# EAGLE design NumberMaze (EAGLE 7.6.0)
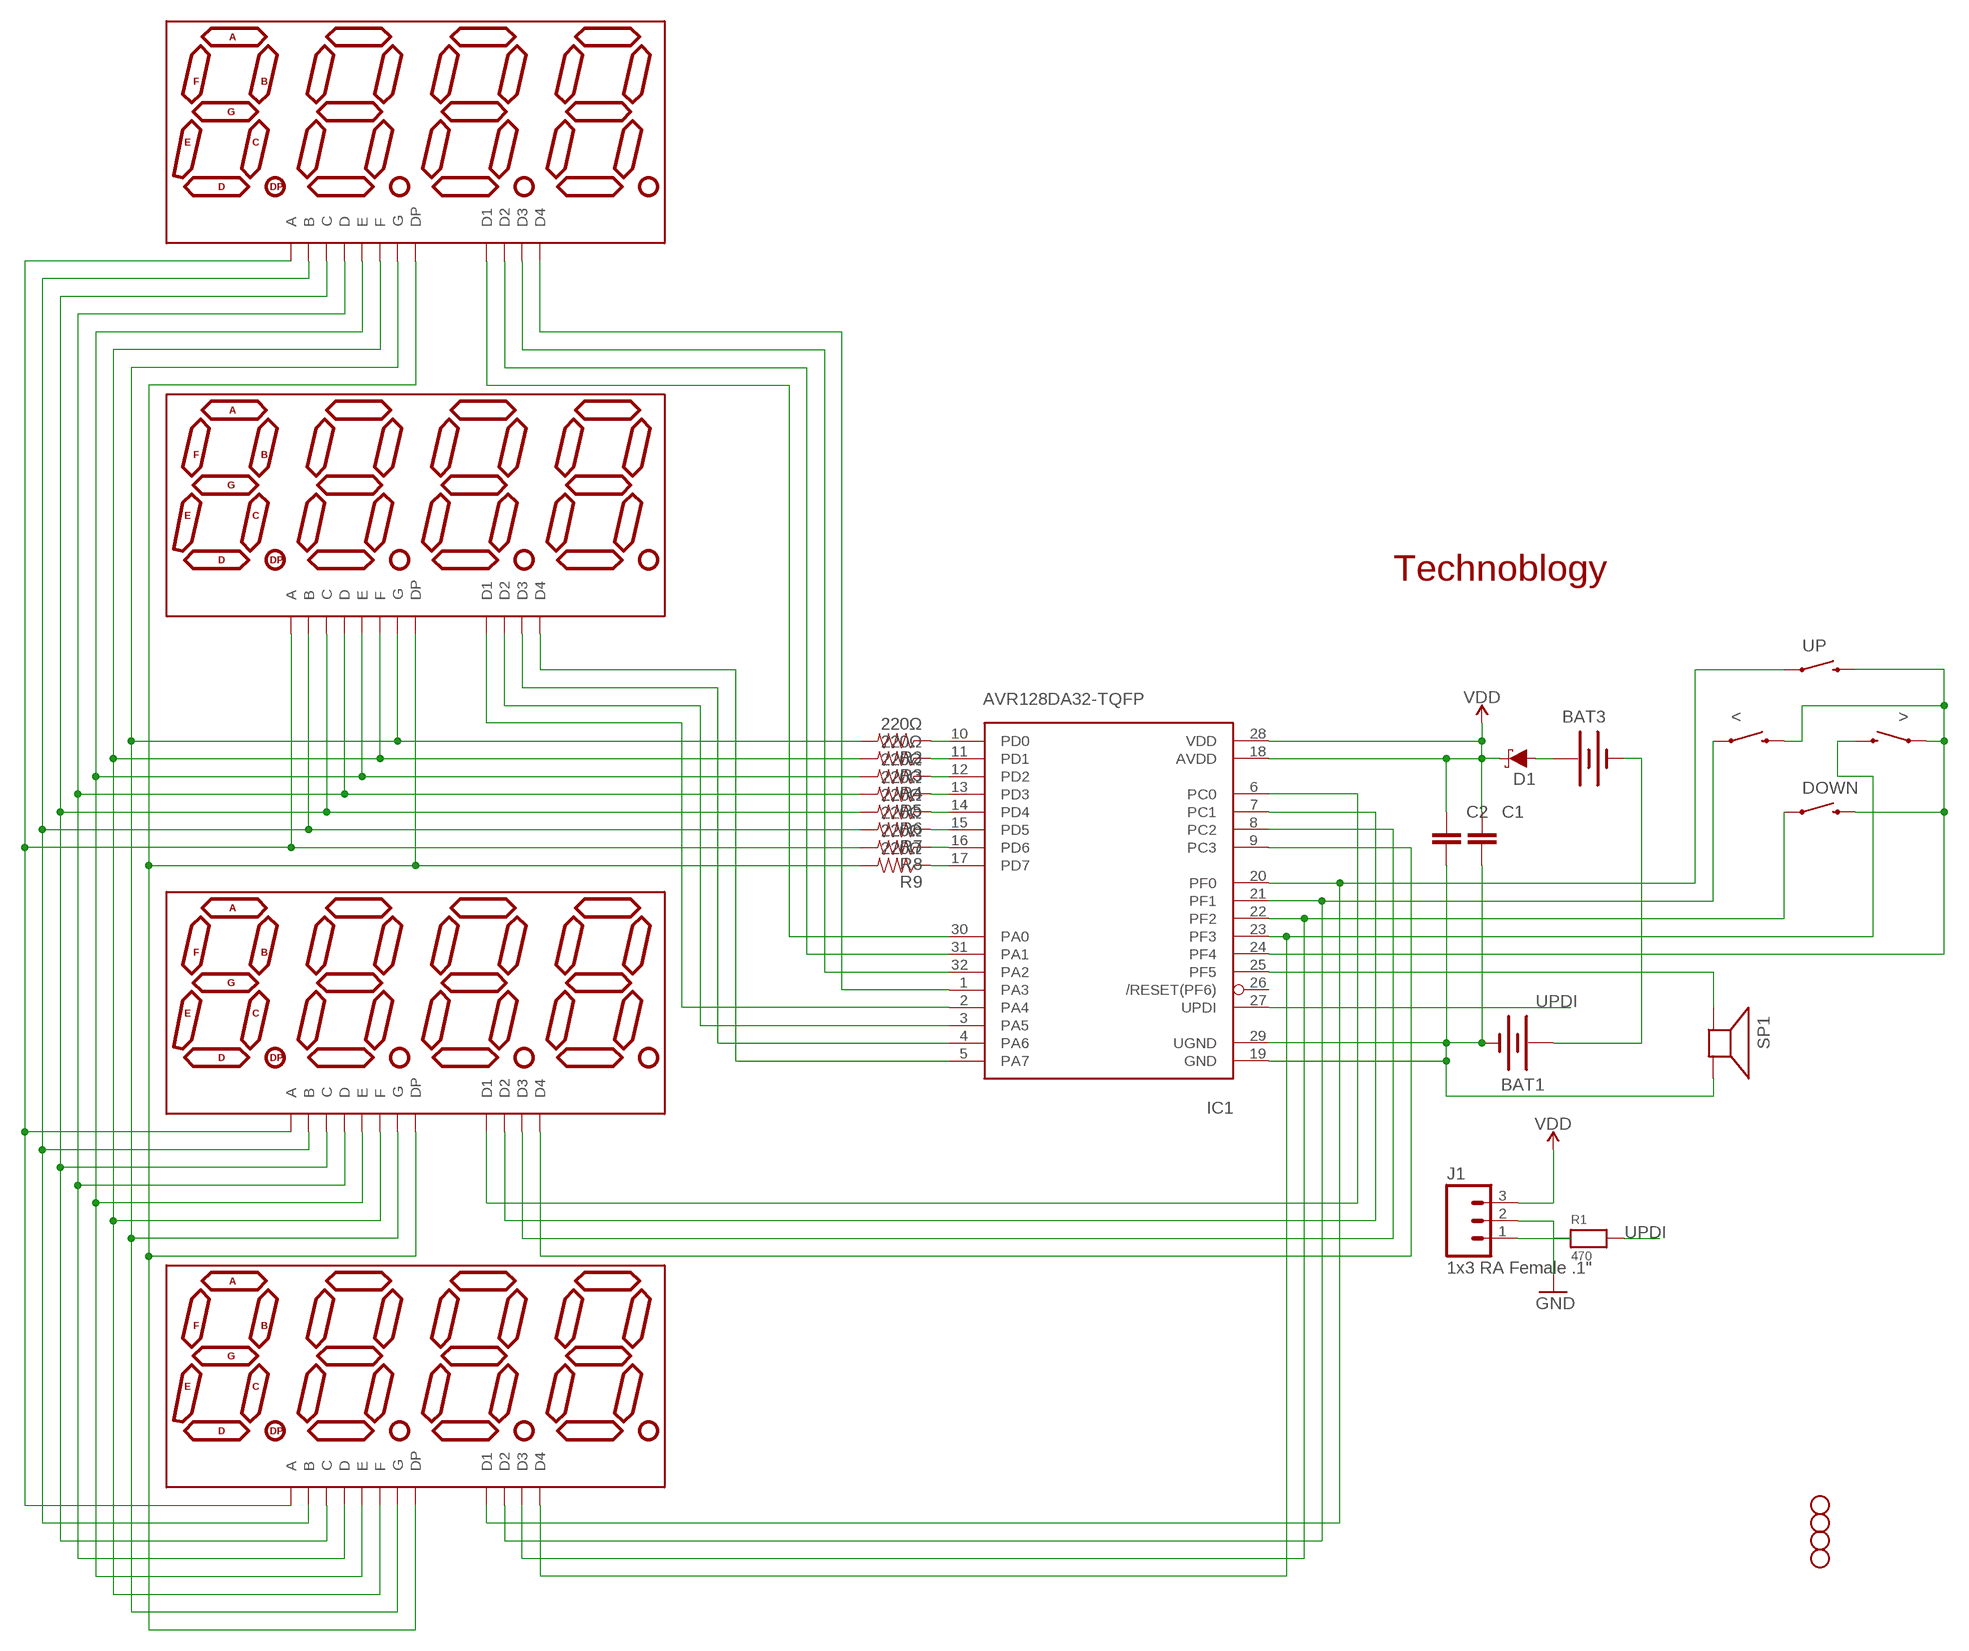
[diagram p0: schematic, sheet 1]

## Parts
<  SWITCH-MOMENTARY-2PTH  [TACTILE-PTH]
>  SWITCH-MOMENTARY-2PTH  [TACTILE-PTH]
BAT1  BATTERYAA-KIT  [BATTERY-AA-KIT]
BAT3  BATTERYAA-KIT  [BATTERY-AA-KIT]
C1  100n  CAP0805  [0805]
C2  100n  CAP0805  [0805]
D1  3A/10V/280mV  DIODE-SCHOTTKY-BAT60A  [SOD-323]
DISP1  KYX-2381  LD-2481-KYX-2381  [KYX-2381]
DISP2  KYX-2381  LD-2481-KYX-2381  [KYX-2381]
DISP3  KYX-2381  LD-2481-KYX-2381  [KYX-2381]
DISP4  KYX-2381  LD-2481-KYX-2381  [KYX-2381]
DOWN  SWITCH-MOMENTARY-2PTH  [TACTILE-PTH]
IC1  AVR128DA32-TQFP  [TQFP32-08]
J1  1x3 RA Female .1"  M03SMD_RA_FEMALE  [1X03_SMD_RA_FEMALE]
JP1  STAND-OFF  [STAND-OFF]
JP2  STAND-OFF  [STAND-OFF]
JP4  STAND-OFF  [STAND-OFF]
JP5  STAND-OFF  [STAND-OFF]
R1  470  RESISTOR_0805MP  [_0805MP]
R2  220Ω  RESISTOR0805-RES  [0805]
R3  220Ω  RESISTOR0805-RES  [0805]
R4  220Ω  RESISTOR0805-RES  [0805]
R5  220Ω  RESISTOR0805-RES  [0805]
R6  220Ω  RESISTOR0805-RES  [0805]
R7  220Ω  RESISTOR0805-RES  [0805]
R8  220Ω  RESISTOR0805-RES  [0805]
R9  220Ω  RESISTOR0805-RES  [0805]
SP1  SPEAKER/AL60P  [AL60P]
UP  SWITCH-MOMENTARY-2PTH  [TACTILE-PTH]

## Nets
GND: BAT1.GND@1(-) C1.2 C2.2 IC1.19(GND) IC1.29(UGND) J1.2 SP1.2(-)
N$1: DISP1.11(A) DISP2.11(A) DISP3.11(A) DISP4.11(A) R8.2
N$2: DISP1.7(B) DISP2.7(B) DISP3.7(B) DISP4.7(B) R7.2
N$3: DISP1.4(C) DISP2.4(C) DISP3.4(C) DISP4.4(C) R6.2
N$4: DISP1.2(D) DISP2.2(D) DISP3.2(D) DISP4.2(D) R5.2
N$5: DISP1.1(E) DISP2.1(E) DISP3.1(E) DISP4.1(E) R4.2
N$6: DISP1.10(F) DISP2.10(F) DISP3.10(F) DISP4.10(F) R3.2
N$7: DISP1.5(G) DISP2.5(G) DISP3.5(G) DISP4.5(G) R2.2
N$8: DISP1.3(DP) DISP2.3(DP) DISP3.3(DP) DISP4.3(DP) R9.2
N$9: IC1.17(PD7) R9.1
N$10: IC1.16(PD6) R8.1
N$11: IC1.15(PD5) R7.1
N$12: IC1.14(PD4) R6.1
N$13: IC1.13(PD3) R5.1
N$14: IC1.12(PD2) R4.1
N$15: IC1.11(PD1) R3.1
N$16: IC1.10(PD0) R2.1
N$17: BAT3.PWR@1(+) D1.A
N$18: IC1.25(PF5) SP1.1(+)
N$19: DISP3.9(D2) IC1.7(PC1)
N$20: BAT1.PWR@1(+) BAT3.GND@1(-)
N$21: DISP1.6(D4) IC1.1(PA3)
N$22: DISP3.6(D4) IC1.9(PC3)
N$23: DISP1.12(D1) IC1.30(PA0)
N$24: DISP1.9(D2) IC1.31(PA1)
N$25: DISP1.8(D3) IC1.32(PA2)
N$26: <.3 >.1 DOWN.3 IC1.24(PF4) UP.3
N$27: DISP2.6(D4) IC1.5(PA7)
N$28: DISP2.8(D3) IC1.4(PA6)
N$29: DISP4.12(D1) IC1.20(PF0) UP.1
N$30: <.1 DISP4.9(D2) IC1.21(PF1)
N$32: DISP4.8(D3) DOWN.1 IC1.22(PF2)
N$33: >.3 DISP4.6(D4) IC1.23(PF3)
N$35: DISP3.8(D3) IC1.8(PC2)
N$36: J1.1 R1.1
N$37: DISP3.12(D1) IC1.6(PC0)
N$38: DISP2.9(D2) IC1.3(PA5)
N$39: DISP2.12(D1) IC1.2(PA4)
UPDI: IC1.27(UPDI) R1.2
VDD: C1.1 C2.1 D1.C IC1.18(AVDD) IC1.28(VDD) J1.3
Unconnected: IC1.26(/RESET(PF6))

## Notes on the sheet
- Technoblogy

## Library data of the parts
< > DOWN UP = SparkFun-Electromechanical:SWITCH-MOMENTARY-2: Various NO switches- pushbuttons, reed, etc; PROD_ID: SWCH-08441
BAT1 BAT3 = SparkFun-Electromechanical:BATTERY: Battery Holders Various common sizes : AA, AAA, 18650 (PRT-12895), 20mm coin cell and 12mm coin cell. 20MM_4LEGS, BATT-10373; PROD_ID: BATT-08316
C1 C2 = SparkFun-Capacitors:CAP: Capacitor Standard 0603 ceramic capacitor, and 0.1" leaded capacitor.
D1 = SparkFun-DiscreteSemi:DIODE-SCHOTTKY: Schottky diode A Schottky diode is a semiconductor diode which has a low forward voltage drop and a very fast switching action.; PROD_ID: DIO-14072
DISP1-DISP4 = technoblogy:LD-2481
IC1 = technoblogy:AVR128DA32: ATmega32u2 Pin compatible with the atmega8u2, atmega16u2 and atmega32u2 8, 16 or 32 K flash, 1K RAM, 512b EEPROM 8 bit and 16 bit timer (5 PWM total) UART, SPI (no I2C!) USB with 4 endpoints, LUFA compatible 22 I/O lines, analog comparator (no ADC!) Comes with DFU bootloader burned in!
J1 = SparkFun-Connectors:M03: Header 3 Standard 3-pin 0.1" header. Use with straight break away headers (SKU : PRT-00116), right angle break away headers (PRT-00553), swiss pins (PRT-00743), machine pins (PRT-00117), and female headers (PRT-00115). Molex polarized connector foot print use with SKU : PRT-08232 with associated crimp pins and housings.; PROD_ID: CONN-10926
JP1 JP2 JP4 JP5 = SparkFun:STAND-OFF: Stand Off This is the mechanical footprint for a #4 phillips button head screw. Use the keepout ring to avoid running the screw head into surrounding components. SKU : PRT-00447
R1 = microbuilder:RESISTOR: Resistors 0402 - 0402 Surface Mount Package 22 Ohm 1% 1/16W [Digikey: 311-22.0LRTR-ND] 33 Ohm 5% 1/16W 1.0K 5% 1/16W 1.5K 5% 1/16W 2.0K 1% 1/16W 10.0K 1% 1/16W [Digikey: 311-10.0KLRTR-ND] 10.0K 5% 1/16W [Digikey: RMCF0402JT10K0TR-ND] 12.1K 1% 1/16W [Digikey: 311-22.0LRTR-ND] 100.0K 5% 1/16W 0603 - 0603 Surface Mount Package 0 Ohm 1/10 Watt 1% Resistor 15 Ohm 1/10 Watt 1% Resistor 33 Ohm 1/10 Watt 1% Resistor 49.9 Ohm 1/10 Watt 1% Resistor 100 Ohm 1/10 Watt 1% Resistor 150 Ohm 1/10 Watt 1% Resistor 240 Ohm 1/10 Watt 1% Resistor 390 Ohm 1/10 Watt 1% Resistor 560 Ohm 1/10 Watt 1% Resistor 680 Ohm 1/10 Watt 1% Resistor 750 Ohm 1/10 Watt 1% Resistor 1.0K Ohm 1/10 Watt 1% Resistor 1.5K Ohm 1/10 Watt 1% Resistor 2.0K Ohm 1/10 Watt 1% Resistor 2.2K Ohm 1/10 Watt 1% Resistor 3.3K Ohm 1/10 Watt 1% Resistor 4.7K Ohm 1/10 Watt 1% Resistor 10.0K Ohm 1/10 Watt 1% Resistor 12.0K Ohm 1/10 Watt 1% Resistor 12.1K Ohm 1/10 Watt 1% Resistor 20.0K Ohm 1/10 Watt 1% Resistor 33.0K Ohm 1/10 Watt 1% Resistor 100.0K Ohm 1/10 Watt 1% Resistor 0805 - 0805 Surface Mount Package 0 Ohm 1/8 Watt 1% Resistor 33 Ohm 1/8 Watt 1% Resistor 100 Ohm 1/8 Watt 1% Resistor 150 Ohm 1/8 Watt 1% Resistor 200 Ohm 1/8 Watt 1% Resistor 240 Ohm 1/8 Watt 1% Resistor 330 Ohm 1/8 Watt 1% Resistor 390 Ohm 1/8 Watt 1% Resistor 470 Ohm 1/8 Watt 1% Resistor 1.0K Ohm 1/8 Watt 1% Resistor 1.5K Ohm 1/8 Watt 1% Resistor 2.0K Ohm 1/8 Watt 1% Resistor 4.7K Ohm 1/8 Watt 1% Resistor 5.1K Ohm 1/8 Watt 1% Resistor 5.6K Ohm 1/8 Watt 1% Resistor 10.0K Ohm 1/8 Watt 1% Resistor 22.0K Ohm 1/8 Watt 1% Resistor 33.0K Ohm 1/8 Watt 1% Resistor 100K Ohm 1/8 Watt 1% Resistor 1206 - 1206 Surface Mount Package 2012 - 2010 Surface Mount Package 0.11 Ohm 1/2 Watt 1% Resistor - Digikey: RHM.11UCT-ND
R2-R9 = SparkFun-Resistors:RESISTOR: Resistor Basic schematic elements and footprints for 0603, 1206, and PTH resistors.
SP1 = adafruit:SPEAKER: SPEAKER Source: Buerklin Added PS12 (for part # PS1240 piezo) http://www.ladyada.net/library/pcb/eaglelibrary.html

## Net classes
0 default: width 0.152 mm, drill 0.305 mm, clearance 0.152 mm

## Board
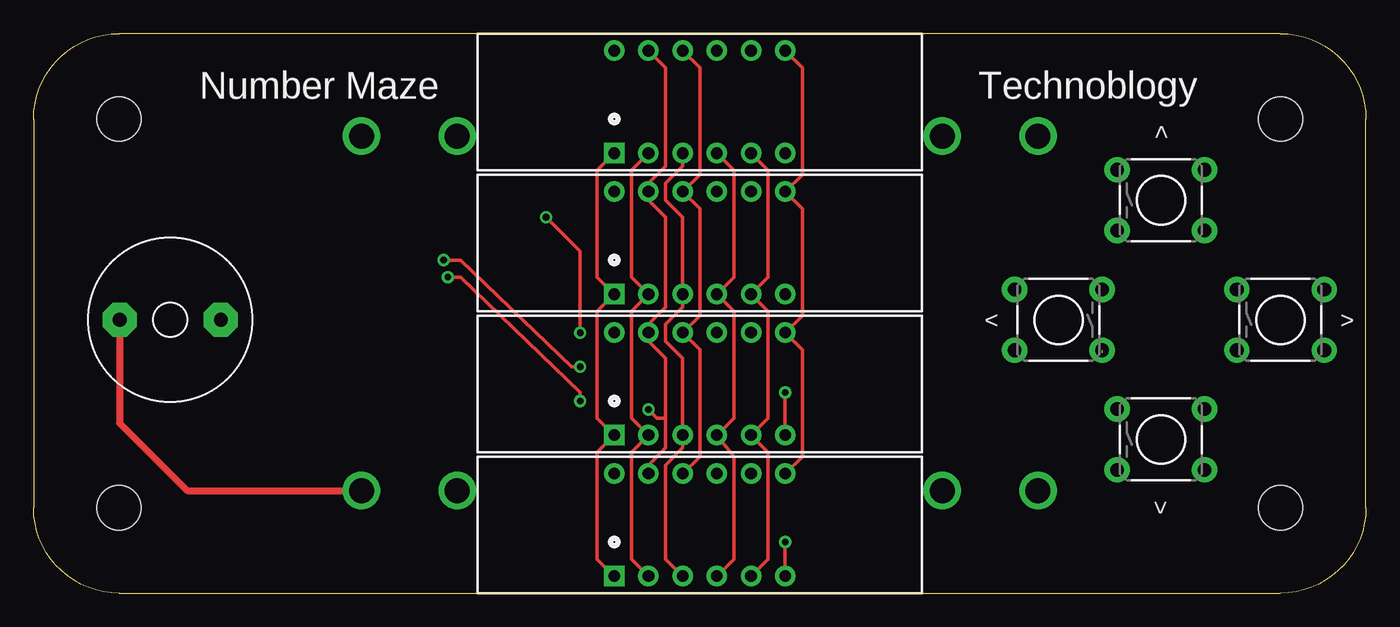
[diagram p1: board, top side]
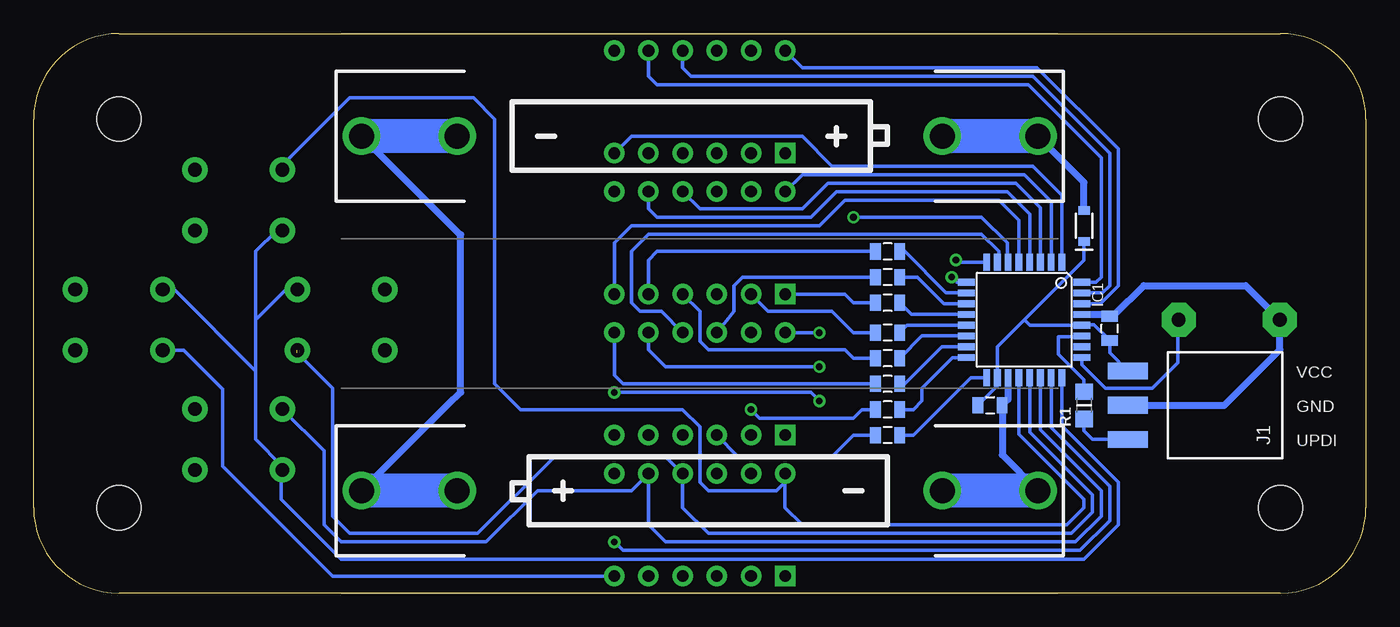
[diagram p2: board, bottom side, seen from below]

Size 99.06 x 41.59 mm. Coordinates in mm from the lower left corner, seen from the top.
Outline: 6.35,0 92.71,0 arc90 99.06,6.35 99.06,35.24 arc90 92.71,41.59 6.35,41.59 arc90 0,35.24 0,6.35 arc90 6.35,0
Copper layers (1*16): Top 0.035mm / dielectric 1.5mm / Bottom 0.035mm
Design rules "default *": minimum track width 10mil, minimum drill 24mil, track to track 8mil, track to pad 8mil, pad to pad 8mil, via to via 8mil, smd to smd 8mil, copper to edge 40mil, drill to drill 8mil, minimum pad ring 10mil, minimum via ring 8mil, stop-mask expansion 4mil, vias tented up to drill 20mil, thermal gap 10mil

### Footprints (pad centres in the part's own frame; a part is rotated, then mirrored left to right if it is on the bottom)
TACTILE-PTH = drill 1.016 pad 1.88: 1 -3.251,2.261; 2 3.251,2.261; 3 -3.251,-2.261; 4 3.251,-2.261
BATTERY-AA-KIT = drill 1.854: GND@1 25.146,0; GND@2 18.034,0; PWR@1 -25.146,0; PWR@2 -18.034,0
0805 = smd 0.8 x 1.2: 1 -0.9,0; 2 0.9,0
SOD-323 = smd 0.63 x 0.83: A 1.15,0; C -1.15,0
KYX-2381 = drill 0.864 pad 1.524 square: 1 -6.35,-3.81 | drill 0.864 pad 1.524: 2 -3.81,-3.81; 3 -1.27,-3.81; 4 1.27,-3.81; 5 3.81,-3.81; 6 6.35,-3.81; 7 6.35,3.81; 8 3.81,3.81; 9 1.27,3.81; 10 -1.27,3.81; 11 -3.81,3.81; 12 -6.35,3.81
TQFP32-08 = smd 1.27 x 0.508: 1 -4.293,2.8; 2 -4.293,2; 3 -4.293,1.2; 4 -4.293,0.4; 5 -4.293,-0.4; 6 -4.293,-1.2; 7 -4.293,-2; 8 -4.293,-2.8; 17 4.293,-2.8; 18 4.293,-2; 19 4.293,-1.2; 20 4.293,-0.4; 21 4.293,0.4; 22 4.293,1.2; 23 4.293,2; 24 4.293,2.8 | smd 0.508 x 1.27: 9 -2.8,-4.293; 10 -2,-4.293; 11 -1.2,-4.293; 12 -0.4,-4.293; 13 0.4,-4.293; 14 1.2,-4.293; 15 2,-4.293; 16 2.8,-4.293; 25 2.8,4.293; 26 2,4.293; 27 1.2,4.293; 28 0.4,4.293; 29 -0.4,4.293; 30 -1.2,4.293; 31 -2,4.293; 32 -2.8,4.293
1X03_SMD_RA_FEMALE = smd 1.25 x 3: 1 -2.54,7.225; 2 0,7.225; 3 2.54,7.225
STAND-OFF = hole 3.302: 0,0
_0805MP = smd 1.2 x 1.3: 1 -1.016,0; 2 1.016,0
AL60P = drill 1.016 pad 2.54 octagon: 1 -3.759,0; 2 3.759,0

### Placement (x,y rotation side)
<  76.2,20.32 180 top
>  92.71,20.32 0 top
BAT1  49.53,7.62 0 bottom
BAT3  49.53,33.97 180 bottom
C1  27.94,13.97 0 bottom
C2  19.05,19.68 90 bottom
D1  20.95,27.3 90 bottom
DISP1  49.53,36.51 0 top
DISP2  49.53,26.04 0 top
DISP3  49.53,15.56 0 top
DISP4  49.53,5.08 0 top
DOWN  83.82,11.43 0 top
IC1  25.4,20.32 270 bottom
J1  10.48,13.97 90 bottom
JP1  6.35,35.24 0 top
JP2  6.35,6.35 0 top
JP4  92.71,35.24 0 top
JP5  92.71,6.35 0 top
R1  20.95,13.97 90 bottom
R2  35.56,25.4 180 bottom
R3  35.56,23.5 180 bottom
R4  35.56,21.59 180 bottom
R5  35.56,19.37 180 bottom
R6  35.56,17.46 180 bottom
R7  35.56,15.56 180 bottom
R8  35.56,13.65 180 bottom
R9  35.56,11.75 180 bottom
SP1  10.16,20.32 180 top
UP  83.82,29.21 0 top

### Tracks (layer width: path | path; a pad name or v marks a point on that pad's centre or on a via)
GND
  Top 0.508: SP1.2 6.4,12.65 11.43,7.62 BAT1.GND@1
  Bottom 0.254: IC1.29 19.05,20.72 C2.2
  Bottom 0.508: BAT1.GND@1 27.04,10.28 C1.2 26.6,14.41 IC1.19 | IC1.29 18.65,20.72 16.51,22.86 8.94,22.86 SP1.2 6.4,18.1 10.53,13.97 J1.2
N$1  (via drill 0.5)
  Top 0.254: DISP1.11 46.99,39.05 46.99,31.75 45.72,30.48 DISP2.11 45.72,29.21 46.99,27.94 46.99,21.27 45.72,20 DISP3.11 45.72,18.73 46.99,17.46 46.99,13.02 | 46.99,13.02 46.99,10.79 45.72,9.53 DISP4.11 | v45.72,13.65 46.35,13.02 46.99,13.02
  Bottom 0.254: v45.72,13.65 45.09,13.02 38.1,13.02 37.47,13.65 R8.2
N$2
  Top 0.254: DISP1.7 57.15,39.05 57.15,31.11 DISP2.7 57.15,28.57 57.15,20.64 DISP3.7 57.15,18.1 57.15,10.16 DISP4.7
  Bottom 0.254: R7.2 55.24,15.56 55.88,16.19 DISP3.7
N$3
  Top 0.254: DISP1.4 52.07,31.43 52.07,23.5 DISP2.4 52.07,20.95 52.07,13.02 DISP3.4 52.07,10.16 52.07,2.54 DISP4.4
  Bottom 0.254: R6.2 38.1,17.46 38.73,18.1 48.9,18.1 49.53,18.73 49.53,20.95 DISP2.4
N$4
  Top 0.254: DISP4.2 44.45,2.54 44.45,10.48 DISP3.2 44.45,13.02 44.45,20.95 DISP2.2 44.45,23.5 44.45,31.43 DISP1.2
  Bottom 0.254: R5.2 38.1,19.37 39.69,20.95 44.45,20.95 DISP2.2
N$5
  Top 0.254: DISP1.1 41.91,31.43 41.91,23.5 DISP2.1 41.91,20.95 41.91,13.02 DISP3.1 41.91,10.48 41.91,2.54 DISP4.1
  Bottom 0.254: R4.2 38.1,21.59 38.73,22.23 DISP2.1
N$6
  Top 0.254: DISP1.10 49.53,39.05 49.53,31.11 DISP2.10 49.53,28.57 49.53,20.64 DISP3.10 49.53,18.1 49.53,10.16 DISP4.10
  Bottom 0.254: R3.2 46.35,23.5 46.99,22.86 46.99,20.95 DISP3.10
N$7
  Top 0.254: DISP4.5 54.61,2.54 54.61,10.48 DISP3.5 54.61,13.02 54.61,20.95 DISP2.5 54.61,23.5 54.61,31.43 DISP1.5
  Bottom 0.254: R2.2 52.7,25.4 53.34,24.77 DISP2.5
N$8
  Top 0.254: DISP1.3 48.26,31.75 46.99,30.48 46.99,29.21 48.26,27.94 DISP2.3 48.26,21.27 46.99,20 46.99,18.73 48.26,17.46 DISP3.3 48.26,10.79 46.99,9.53 46.99,2.54 DISP4.3
  Bottom 0.254: R9.2 38.1,11.75 39.69,10.16 46.67,10.16 DISP3.3
N$9
  Bottom 0.254: IC1.17 29.38,16.03 33.66,11.75 R9.1
N$10
  Bottom 0.254: IC1.16 30.74,17.52 33.02,15.24 33.02,14.29 33.66,13.65 R8.1
N$11
  Bottom 0.254: IC1.15 31.53,18.32 34.29,15.56 R7.1
N$12
  Bottom 0.254: IC1.14 33,19.12 R6.1
N$13
  Bottom 0.254: IC1.13 34.11,19.92 R5.1
N$14
  Bottom 0.254: 34.42,21.36 R4.1 33.79,20.72 IC1.12
N$15
  Bottom 0.254: IC1.11 31.36,21.52 33.34,23.5 R3.1
N$16
  Bottom 0.254: IC1.10 31.21,22.32 34.29,25.4 R2.1
N$17
  Bottom 0.508: D1.A 20.95,30.54 BAT3.PWR@1
N$18
  Bottom 0.254: IC1.25 21.11,16.98 19.37,15.24 15.88,15.24 13.97,17.14 13.97,20.27 SP1.1
N$19
  Bottom 0.254: DISP3.9 52.39,20.95 53.98,20.95 54.61,21.59 54.61,25.4 53.34,26.67 28.57,26.67 27.3,25.4 27.3,24.71 IC1.7
N$20
  Bottom 0.508: BAT1.PWR@1 68.33,13.97 67.31,14.92 67.31,26.67 67.37,26.67 BAT3.GND@1
N$21
  Bottom 0.254: IC1.1 22.6,29.59 24.77,31.75 39.69,31.75 41.91,33.97 54.61,33.97 DISP1.6
N$22  (via drill 0.5)
  Top 0.254: v55.88,14.92 DISP3.6 | v30.8,23.5 31.75,23.5 40.64,14.92 v40.64,14.29
  Bottom 0.254: v55.88,14.92 41.27,14.92 v40.64,14.29 | IC1.9 30.42,23.12 v30.8,23.5
N$23
  Bottom 0.254: IC1.30 19.75,21.52 18.41,22.86 18.41,33.02 24.45,39.05 41.91,39.05 DISP1.12
N$24
  Bottom 0.254: IC1.31 19.59,22.32 19.05,22.86 19.05,32.7 24.77,38.42 50.16,38.42 50.8,39.05 DISP1.9
N$25
  Bottom 0.254: IC1.32 20.06,23.12 19.68,23.5 19.68,32.38 25.08,37.78 52.7,37.78 53.34,38.42 DISP1.8
N$26
  Bottom 0.254: IC1.24 22.6,12.44 18.41,8.26 18.41,5.08 20.95,2.54 76.2,2.54 80.64,6.99 80.64,9.09 DOWN.3 80.57,9.45 82.55,11.43 82.55,16.51 | 82.55,16.51 82.55,20.32 | 82.55,20.32 82.55,25.4 81,26.95 UP.3 | >.1 88.62,22.58 82.55,16.51 | <.3 80.29,22.58 82.55,20.32
N$27
  Bottom 0.254: IC1.5 25.8,27.7 27.3,29.21 38.73,29.21 40.64,27.3 54.61,27.3 55.88,26.04 DISP2.6
N$28
  Bottom 0.254: IC1.4 25,28.18 26.67,29.84 39.37,29.84 41.27,27.94 52.7,27.94 53.34,28.57 DISP2.8
N$29
  Bottom 0.254: 43.18,8.26 43.18,6.35 41.91,5.08 22.23,5.08 20.95,6.35 20.95,6.99 25.8,11.83 IC1.20 | 43.18,8.26 DISP4.12 | 43.18,8.26 43.81,7.62 48.9,7.62 49.53,8.26 49.53,12.38 50.8,13.65 62.87,13.65 64.77,15.56 64.77,35.24 66.36,36.83 75.56,36.83 80.57,31.83 UP.1
N$30  (1 unrouted)
  Bottom 0.254: IC1.21 25,11.98 20.32,7.3 20.32,6.03 21.91,4.45 48.9,4.45 50.8,6.35 DISP4.9 52.07,10.16 60.33,10.16 66.04,4.45 75.56,4.45 76.83,5.71 76.83,15.24 79.45,17.86
N$31
  Bottom 2.54: 24.45,7.62 31.43,7.62 | 67.63,7.62 74.61,7.62 | 67.63,33.97 74.61,33.97 | 24.45,33.97 31.43,33.97
N$32
  Bottom 0.254: IC1.22 24.2,12.13 19.68,7.62 19.68,5.71 21.59,3.81 52.07,3.81 53.34,5.08 DISP4.8 54.61,7.62 61.59,7.62 65.41,3.81 76.2,3.81 77.47,5.08 77.47,10.59 DOWN.1
N$33  (via drill 0.5)
  Top 0.254: v55.88,3.81 DISP4.6
  Bottom 0.254: IC1.23 23.4,12.29 19.05,7.94 19.05,5.4 21.27,3.17 55.24,3.17 v55.88,3.81 | DISP4.6 76.83,1.27 85.01,9.45 85.01,15.16 87.91,18.06 >.3
N$35  (via drill 0.5)
  Top 0.254: v30.48,24.77 31.75,24.77 40.01,16.83 v40.64,16.83
  Bottom 0.254: IC1.8 30.33,24.61 v30.48,24.77 | v40.64,16.83 52.07,16.83 53.34,18.1 DISP3.8
N$36
  Bottom 0.254: 20.95,13.34 R1.1 20.95,12.06 20.32,11.43 J1.1
N$37  (via drill 0.5)
  Top 0.254: v40.64,19.37 40.64,25.4 v38.1,27.94
  Bottom 0.254: DISP3.12 v40.64,19.37 | v38.1,27.94 28.57,27.94 26.67,26.04 26.67,24.68 IC1.6
N$38
  Bottom 0.254: IC1.3 24.2,28.64 26.04,30.48 40.01,30.48 41.91,28.57 49.53,28.57 DISP2.9
N$39
  Bottom 0.254: IC1.2 23.4,29.11 25.4,31.11 41.91,31.11 DISP2.12
UPDI
  Bottom 0.254: IC1.27 21.18,19.05 22.86,19.05 22.86,17.78 20.95,15.88 R1.2
VDD
  Bottom 0.254: 21.11,19.95 20.21,19.95 C2.1 19.05,17.86 J1.3 | D1.C 20.95,24.77 25.4,20.32 | IC1.28 25,19.92 25.4,20.32 | 25.4,20.32 27.4,18.32 IC1.18 27.4,15.41 C1.1
  Bottom 0.406: 21.11,19.95 IC1.28

### Text on the board
tPlace: Number Maze | Technoblogy | > | >
bPlace: VCC | GND | UPDI